# EAGLE design ArdUNO (EAGLE 7.3.0)
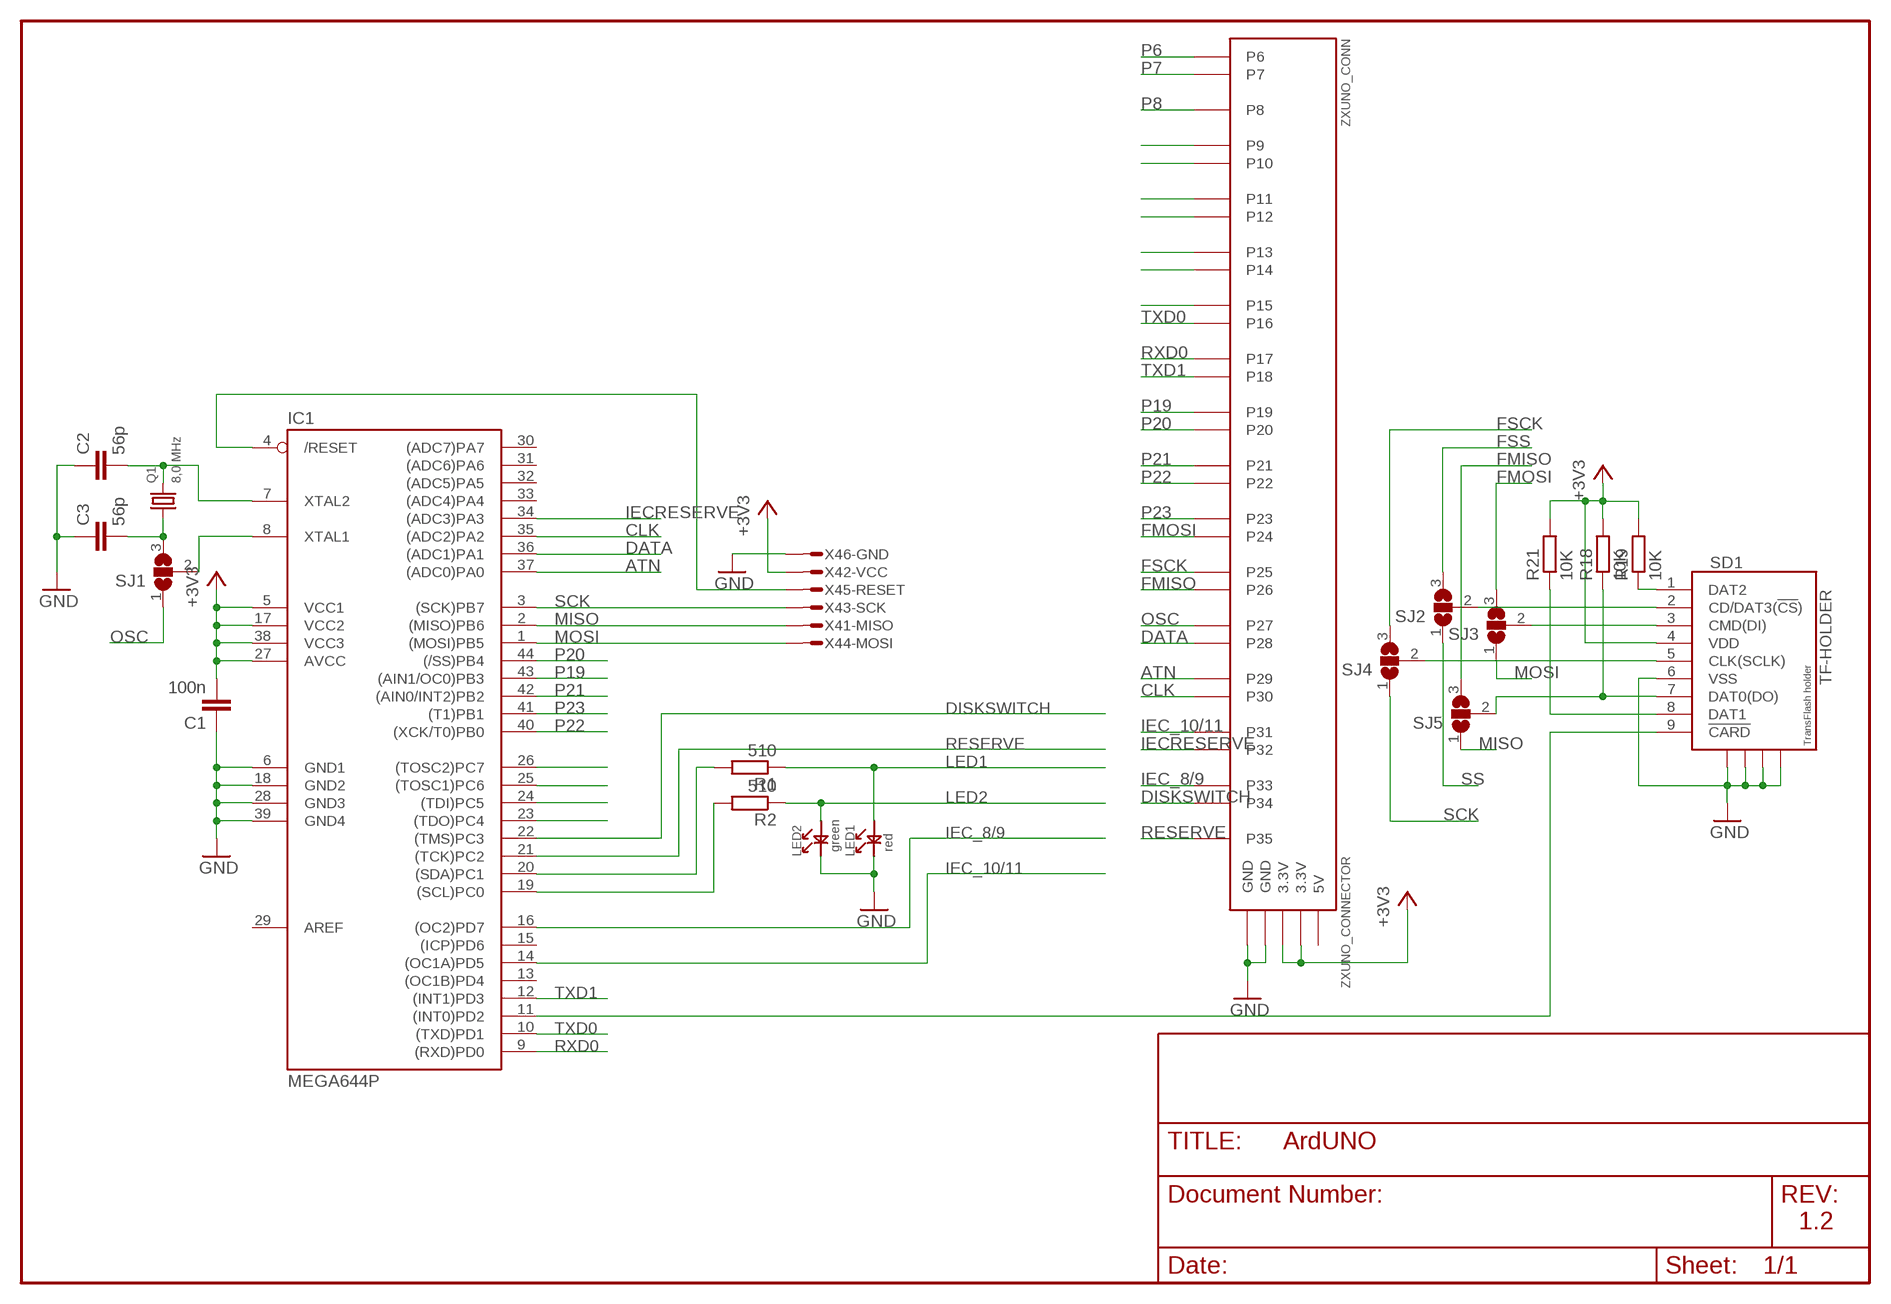
[diagram p0: schematic, sheet 1]

## Parts
C1  100n  C-EUC0805  [C0805]
C2  56p  C-EUC0805  [C0805]
C3  56p  C-EUC0805  [C0805]
IC1  MEGA644P  MEGA16/32TQFP  [TQFP44]
LED1  red  LED0805  [LED0805]
LED2  green  LED0805  [LED0805]
Q1  8,0 MHz  HC49  [HC49/S]
R1  510  R-EU_R0805  [R0805]
R2  510  R-EU_R0805  [R0805]
R18  10K  R-EU_R0805  [R0805]
R19  10K  R-EU_R0805  [R0805]
R21  10K  R-EU_R0805  [R0805]
SD1  TF-HOLDER  [TF-PULL]
SJ1  SJ2W  [SJ_2]
SJ2  SJ2W  [SJ_2]
SJ3  SJ2W  [SJ_2]
SJ4  SJ2W  [SJ_2]
SJ5  SJ2W  [SJ_2]
X4  AVR-ISP_1X6  [1X6_ISP]
ZXUNO_CONN  ZXUNO_CONNECTOR  [ZXUNO_CONNECTOR]

## Nets
+3V3 [power]: C1.2 IC1.5(VCC1) IC1.17(VCC2) IC1.27(AVCC) IC1.38(VCC3) R18.2 R19.2 R21.2 SD1.4(VDD) X4.2 ZXUNO_CONN.3.3V@1(3.3V) ZXUNO_CONN.3.3V@2(3.3V)
/RESET: IC1.4(/RESET) X4.5
ATN: IC1.37((ADC0)PA0) ZXUNO_CONN.P29
CD: IC1.11((INT0)PD2) SD1.9(!CARD)
CLK: IC1.35((ADC2)PA2) ZXUNO_CONN.P30
DATA: IC1.36((ADC1)PA1) ZXUNO_CONN.P28
DISKSWITCH: IC1.22((TMS)PC3) ZXUNO_CONN.P34
FMISO: SJ5.3 ZXUNO_CONN.P26
FMOSI: SJ3.3 ZXUNO_CONN.P24
FSCK: SJ4.3 ZXUNO_CONN.P25
FSS: SJ2.3
GND: C1.1 C2.1 C3.1 IC1.6(GND1) IC1.18(GND2) IC1.28(GND3) IC1.39(GND4) LED1.1 LED2.1 SD1.6(VSS) SD1.S1 SD1.S2 SD1.S3 SD1.S4 X4.6 ZXUNO_CONN.GND@1(GND) ZXUNO_CONN.GND@2(GND)
IEC_8/9: IC1.16((OC2)PD7) ZXUNO_CONN.P33
IEC_10/11: IC1.14((OC1A)PD5) ZXUNO_CONN.P31
IECRESERVE: IC1.34((ADC3)PA3) ZXUNO_CONN.P32
LED1: LED1.2 R1.1
LED2: LED2.2 R2.1
MISO: IC1.2((MISO)PB6) SJ5.1 X4.1
MOSI: IC1.1((MOSI)PB5) SJ3.1 X4.4
N$1: IC1.23((TDO)PC4)
N$2: R18.1 SD1.7(DAT0(DO)) SJ5.2
N$3: SD1.3(CMD(DI)) SJ3.2
N$4: C3.2 Q1.1 SJ1.3
N$5: C2.2 IC1.7(XTAL2) Q1.2
N$6: SD1.2(CD/DAT3(!CS!)) SJ2.2
N$7: IC1.24((TDI)PC5)
N$8: IC1.8(XTAL1) SJ1.2
N$9: R19.1 SD1.1(DAT2)
N$10: SD1.5(CLK(SCLK)) SJ4.2
N$11: IC1.25((TOSC1)PC6)
N$12: IC1.26((TOSC2)PC7)
N$13: R21.1 SD1.8(DAT1)
OSC: SJ1.1 ZXUNO_CONN.P27
P6: ZXUNO_CONN.P6
P7: ZXUNO_CONN.P7
P8: ZXUNO_CONN.P8
P9: ZXUNO_CONN.P9
P10: ZXUNO_CONN.P10
P11: ZXUNO_CONN.P11
P12: ZXUNO_CONN.P12
P13: ZXUNO_CONN.P13
P14: ZXUNO_CONN.P14
P15: ZXUNO_CONN.P15
P19: IC1.43((AIN1/OC0)PB3) ZXUNO_CONN.P19
P20: IC1.44((/SS)PB4) ZXUNO_CONN.P20
P21: IC1.42((AIN0/INT2)PB2) ZXUNO_CONN.P21
P22: IC1.40((XCK/T0)PB0) ZXUNO_CONN.P22
P23: IC1.41((T1)PB1) ZXUNO_CONN.P23
PC0: IC1.19((SCL)PC0) R2.2
PC1: IC1.20((SDA)PC1) R1.2
RESERVE: IC1.21((TCK)PC2) ZXUNO_CONN.P35
RXD0: IC1.9((RXD)PD0) ZXUNO_CONN.P17
SCK: IC1.3((SCK)PB7) SJ4.1 X4.3
SS: SJ2.1
TXD0: IC1.10((TXD)PD1) ZXUNO_CONN.P16
TXD1: IC1.12((INT1)PD3) ZXUNO_CONN.P18
Unconnected: IC1.13((OC1B)PD4) IC1.15((ICP)PD6) IC1.29(AREF) IC1.30((ADC7)PA7) IC1.31((ADC6)PA6) IC1.32((ADC5)PA5) IC1.33((ADC4)PA4)

## Notes on the sheet
- 1.2

## Power pins joined to a net without a drawn wire
5V: ZXUNO_CONN.5V

## Library data of the parts
C1-C3 = rcl:C-EU: CAPACITOR, European symbol
IC1 = 0_rr:MEGA16/32: MICROCONTROLLER 16 Kbytes FLASH, 512 bytes EEPROM 1 Kbytes SRAM dual UART hardware multiplier
LED1 LED2 = 0_rr:LED
Q1 = 0_rr:HC49
R1 R2 R18 R19 R21 = rcl:R-EU_: RESISTOR, European symbol
SD1 = sd-mmc:TF-HOLDER: TF / Micro SD socket is PUSH-PUSH type, the card can be pushed into and auto locked and pushed out by simply press the card. Surface Mounting type.
SJ1-SJ5 = jumper:SJ2W: SMD solder JUMPER
X4 = 0_rr:AVR-ISP: MicroMaTch 6 7-215464-6 / 0-215464-6 Drawing Number C-215464 DDEController.pdf
ZXUNO_CONN = zxuno:ZXUNO_CONNECTOR

## Net classes
0 default: width 0.178 mm, clearance 0.178 mm
1 power: width 0.305 mm, clearance 0.178 mm to class 0, clearance 0.229 mm

## Board
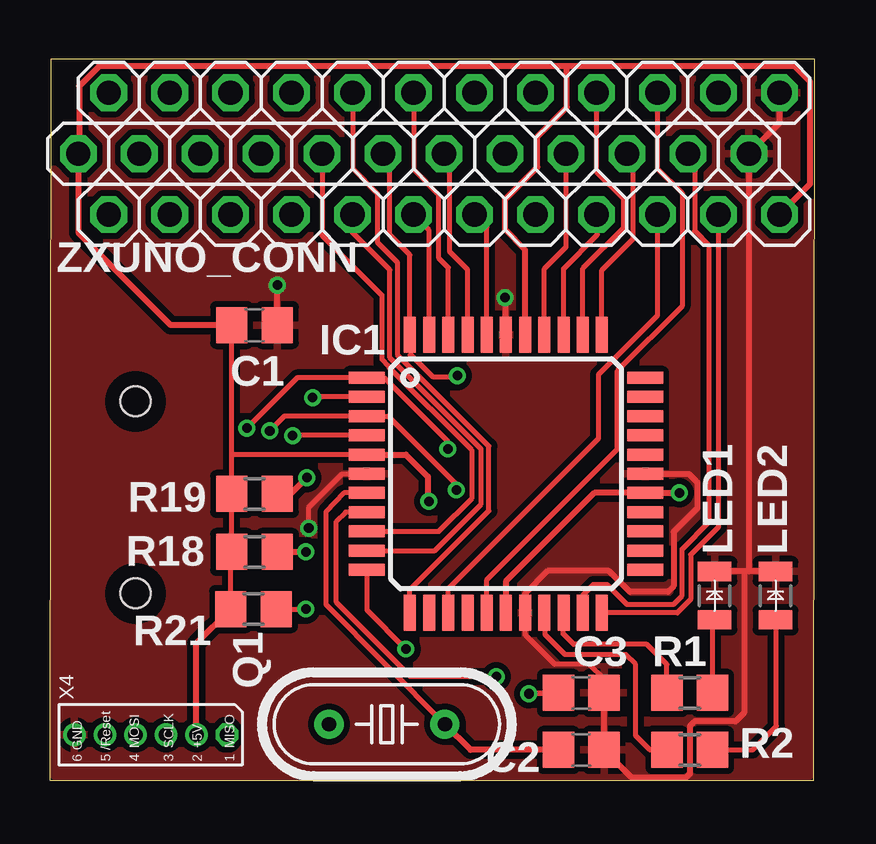
[diagram p1: board, top side]
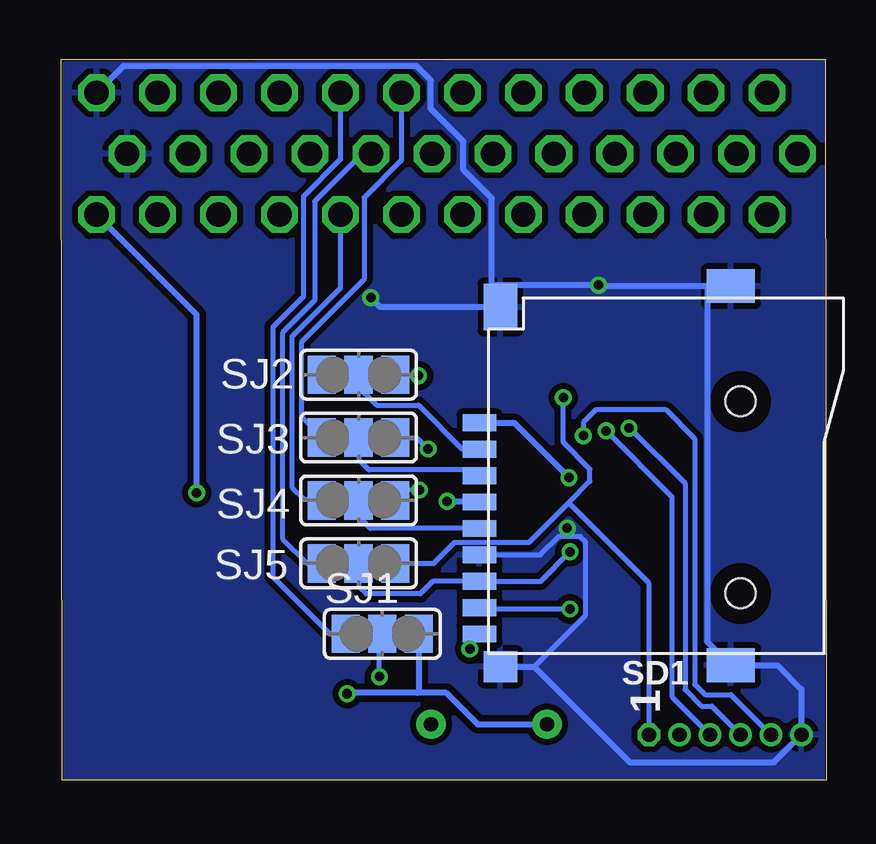
[diagram p2: board, bottom side, seen from below]

No outline drawn. Coordinates in mm, seen from the top.
Copper layers (1*16): Top 0.035mm / dielectric 1.5mm / Bottom 0.035mm
Design rules "default": minimum track width 8mil, minimum drill 12mil, track to track 8mil, track to pad 8mil, pad to pad 8mil, via to via 8mil, smd to smd 8mil, copper to edge 25mil, drill to drill 8mil, minimum pad ring 6mil, minimum via ring 6mil, stop-mask expansion 4mil, vias tented up to drill 12mil, thermal gap 10mil
Milling: 4 lines

### Footprints (pad centres in the part's own frame; a part is rotated, then mirrored left to right if it is on the bottom)
C0805 = smd 1.3 x 1.5: 1 -0.95,0; 2 0.95,0
TQFP44 = smd 1.5 x 0.5: 1 -5.8,4; 2 -5.8,3.2; 3 -5.8,2.4; 4 -5.8,1.6; 5 -5.8,0.8; 6 -5.8,0; 7 -5.8,-0.8; 8 -5.8,-1.6; 9 -5.8,-2.4; 10 -5.8,-3.2; 11 -5.8,-4; 23 5.8,-4; 24 5.8,-3.2; 25 5.8,-2.4; 26 5.8,-1.6; 27 5.8,-0.8; 28 5.8,0; 29 5.8,0.8; 30 5.8,1.6; 31 5.8,2.4; 32 5.8,3.2; 33 5.8,4 | smd 0.5 x 1.5: 12 -4,-5.8; 13 -3.2,-5.8; 14 -2.4,-5.8; 15 -1.6,-5.8; 16 -0.8,-5.8; 17 0,-5.8; 18 0.8,-5.8; 19 1.6,-5.8; 20 2.4,-5.8; 21 3.2,-5.8; 22 4,-5.8; 34 4,5.8; 35 3.2,5.8; 36 2.4,5.8; 37 1.6,5.8; 38 0.8,5.8; 39 0,5.8; 40 -0.8,5.8; 41 -1.6,5.8; 42 -2.4,5.8; 43 -3.2,5.8; 44 -4,5.8
LED0805 = smd 0.8 x 1.4: 1 -1.009,0; 2 1.009,0
HC49/S = drill 0.6 pad 1.219: 1 -2.413,0; 2 2.413,0
R0805 = smd 1.3 x 1.5: 1 -0.95,0; 2 0.95,0
TF-PULL = smd 0.7 x 1.4: 1 -2.2,-7.62; 2 -1.1,-7.62; 3 0,-7.62; 4 1.1,-7.62; 5 2.2,-7.62; 6 3.3,-7.62; 7 4.4,-7.62; 8 5.5,-7.62; 9 6.6,-7.62 | smd 1.4 x 2: S1 -7.9,2.85; S2 7.9,2.85 | smd 1.28 x 1.4: S3 7.96,-6.75 | smd 1.95 x 1.4: S4 -7.025,-6.75 | hole 1.25: -3.1,3.25; 4.9,3.25
SJ_2 = smd 1.168 x 1.6: 1 -1.524,0; 2 0,0; 3 1.524,0
1X6_ISP = drill 0.6 pad 0.94 octagon: 1 0,0 | drill 0.6 pad 0.94: 2 1.27,0; 3 2.54,0; 4 3.81,0; 5 5.08,0; 6 6.35,0
ZXUNO_CONNECTOR = drill 1.016 octagon: 3.3V@1 -13.97,0; 3.3V@2 15.24,-2.54; 5V -12.7,-2.54; GND@1 15.24,2.54; GND@2 13.97,0; NC@1 12.7,2.54; P6 -12.7,2.54; P7 -10.16,-2.54; P8 -11.43,0; P9 -10.16,2.54; P10 -7.62,-2.54; P11 -8.89,0; P12 -7.62,2.54; P13 -5.08,-2.54; P14 -6.35,0; P15 -5.08,2.54; P16 -2.54,-2.54; P17 -3.81,0; P18 -2.54,2.54; P19 0,-2.54; P20 -1.27,0; P21 0,2.54; P22 2.54,-2.54; P23 1.27,0; P24 2.54,2.54; P25 5.08,-2.54; P26 3.81,0; P27 5.08,2.54; P28 7.62,-2.54; P29 6.35,0; P30 7.62,2.54; P31 10.16,-2.54; P32 8.89,0; P33 10.16,2.54; P34 12.7,-2.54; P35 11.43,0

### Placement (x,y rotation side)
C1  8.52,18.97 180 top
C2  22.13,1.27 180 top
C3  22.13,3.65 180 top
IC1  19,12.78 0 top
LED1  27.69,7.7 270 top
LED2  30.23,7.7 270 top
Q1  14.04,2.34 0 top
R1  26.66,3.65 180 top
R2  26.66,1.27 180 top
R18  8.52,9.52 180 top
R19  8.52,11.94 180 top
R21  8.48,7.14 180 top
SD1  6.81,12.7 270 bottom
SJ1  18.48,6.11 0 bottom
SJ2  19.47,16.9 180 bottom
SJ3  19.47,14.28 180 bottom
SJ4  19.47,11.66 180 bottom
SJ5  19.47,9.05 180 bottom
X4  7.37,1.9 180 top
ZXUNO_CONN  15.15,26.11 0 top

### Tracks (layer width: path | path; a pad name or v marks a point on that pad's centre or on a via)
+3V3  (via drill 0.4)
  Top 0.203: R21.2 7.53,10.24 R18.2 R19.2 7.57,13.53 | 7.57,13.53 C1.2 | IC1.5 7.62,13.58 7.57,13.53
  Top 0.254: C1.2 5.03,18.97 1.18,22.82 ZXUNO_CONN.3.3V@1 1.22,26.15 1.22,28.93 2.05,29.76 21.54,29.76 | IC1.17 19,8.29 22.68,11.98 IC1.27 v26.21,11.98 v26.22,11.98 | IC1.17 | IC1.5 14.82,13.58 15.74,12.66 15.74,11.66 v15.78,11.62 | IC1.38 19.8,22.1 18.96,22.94 18.96,24.21 20.31,25.55 20.31,26.82 21.54,28.06 21.54,29.76 | ZXUNO_CONN.3.3V@2 31.66,24.84 31.66,29.13 31.02,29.76 21.54,29.76 | X4.2 6.1,5.71 R21.2
  Bottom 0.254: v15.78,11.62 14.46,11.62 SD1.4 | v26.22,11.98 26.22,19.4 ZXUNO_CONN.3.3V@2
/RESET  (via drill 0.4)
  Top 0.203: IC1.4 10.12,14.38 v10.11,14.36
  Bottom 0.203: X4.5 3.96,3.57 5.03,3.57 5.46,4 5.46,14.24 6.65,15.44 9.59,15.44 10.11,14.92 v10.11,14.36
ATN
  Top 0.203: ZXUNO_CONN.P29 21.5,22.22 20.6,21.32 IC1.37
CD  (via drill 0.4)
  Top 0.203: IC1.11 13.2,7.11 v14.83,5.47
  Bottom 0.203: v14.83,5.47 14.83,5.7 SD1.9
CLK
  Top 0.203: IC1.35 22.2,21.33 23.88,23.02 23.88,24.25 22.77,25.36 ZXUNO_CONN.P30
DATA
  Top 0.203: IC1.36 21.4,21.33 22.81,22.74 22.81,23.53 ZXUNO_CONN.P28
DISKSWITCH
  Top 0.203: ZXUNO_CONN.P34 27.85,10.55 26.7,9.4 26.7,7.54 26.14,6.98 IC1.22
FMISO
  Bottom 0.203: ZXUNO_CONN.P26 19.31,26.11 21.3,24.13 21.3,20 22.65,18.65 22.65,10.08 21.62,9.04 SJ5.3
FMOSI
  Bottom 0.203: ZXUNO_CONN.P24 17.69,25.83 19.23,24.29 19.23,20.87 21.85,18.25 21.85,15.14 SJ3.3
FSCK
  Bottom 0.203: ZXUNO_CONN.P25 20.23,20.52 22.25,18.49 22.25,12.22 21.73,11.7 21.04,11.7 SJ4.3
GND  (via drill 0.4)
  Top 0.203: C3.1 23.08,4.21 22.45,4.84 21.02,4.84 19.79,6.07 IC1.18 | v10.78,10.51 10.78,11.39 12.17,12.78 IC1.6 | IC1.6
  Top 0.254: C3.1 C2.1 24.23,0.12 26.5,0.12 26.66,0.27 26.66,2.26 26.86,2.46 28.56,2.46 28.92,2.81 28.92,8.66 28.88,8.7 | IC1.18 | IC1.18 | LED2.1 29.12,8.7 | 29.12,8.7 28.88,8.7 | 28.88,8.7 LED1.1 | ZXUNO_CONN.GND@1 30.39,27.38 ZXUNO_CONN.GND@2 29.12,8.7 | IC1.28 26.62,12.78 26.97,12.42 26.97,11.35 25.98,10.36 25.98,8.09 25.74,7.86 24.16,7.86 23.28,8.73 20.74,8.73 19.79,7.78 19.8,7.77 IC1.18 | C1.1 v9.47,20.63 | 19.04,20.12 v18.96,20.12 19,20.08 IC1.39
  Bottom 0.203: SD1.6 11.9,9.4 11.14,10.16 10.82,10.16 | 12.15,4.74 10.03,6.86 10.03,9.96 10.23,10.16 10.82,10.16 | v10.78,10.51 10.78,10.2 10.82,10.16
  Bottom 0.254: SD1.S3 12.15,4.74 8.16,0.75 2.17,0.75 X4.6 1.02,3.81 2.01,4.8 SD1.S2 4.95,5.78 4.95,20.6 | SD1.S1 4.95,20.6 | 4.95,20.6 9.43,20.6 v9.47,20.63 13.76,20.63 13.92,20.48 | v18.96,20.12 18.56,19.72 SD1.S4 13.92,19.72 | 13.92,19.72 | 13.92,19.72 13.92,20.48 | 13.92,20.48 13.92,24.25 15.11,25.44 15.11,26.63 16.46,27.98 16.46,29.17 17.05,29.76 29.28,29.76 ZXUNO_CONN.GND@1
  pour Top (isolate 0.254): 0.15,0.19 0.19,29.88 31.66,29.84 31.66,0.2
  pour Bottom (isolate 0.254): 0.15,0.16 0.15,29.92 31.7,29.84 31.66,0.16
IEC_8/9
  Top 0.203: IC1.16 18.2,8.36 23.64,13.81 23.64,17.06 26.34,19.76 26.34,24.48 25.31,25.52 ZXUNO_CONN.P33
IEC_10/11
  Top 0.203: ZXUNO_CONN.P31 25.31,19.36 22.85,16.9 22.85,14.24 16.6,7.99 IC1.14
IECRESERVE
  Top 0.203: IC1.34 23,21.26 24.27,22.54 24.27,25.91 24.08,26.11 ZXUNO_CONN.P32
LED1
  Top 0.203: R1.1 27.61,6.61 LED1.2
LED2
  Top 0.203: R2.1 29.28,1.27 30.27,2.26 30.27,6.61 LED2.2
MISO  (via drill 0.4)
  Top 0.203: IC1.2 10.96,15.98 v10.94,15.95
  Bottom 0.203: X4.1 7.37,8.21 10.72,11.56 | v10.94,15.95 10.94,14.09 9.83,12.97 9.83,12.46 10.72,11.56 | SJ5.1 16.34,9.04 15.46,9.92 12.37,9.92 10.72,11.56
MOSI  (via drill 0.4)
  Top 0.203: 8.16,14.72 v8.2,14.68 10.3,16.78 IC1.1 13.93,16.78 16.58,14.12 v16.58,13.81
  Bottom 0.203: v8.2,14.68 8.16,14.68 5.86,12.38 5.86,3.77 5.19,3.09 4.75,3.09 X4.4 | SJ3.1 17.05,14.28 v16.58,13.81
N$2  (via drill 0.4)
  Top 0.254: R18.1 v10.66,9.52
  Bottom 0.203: SJ5.2 19.43,9.01 19.43,8.05 19.16,7.78 16.89,7.78 16.37,8.3 SD1.7 11.89,8.3 v10.66,9.52
N$3
  Bottom 0.203: SD1.3 14.83,12.7 15.07,12.94 19.04,12.94 19.43,13.33 19.43,14.24 SJ3.2
N$4  (via drill 0.4)
  Top 0.254: C3.2 v19.95,3.61
  Bottom 0.254: SJ1.3 16.96,3.7 17.01,3.65 | Q1.1 14.51,2.34 15.82,3.65 17.01,3.65 | Q1.1 | 17.01,3.65 19.91,3.65 v19.95,3.61
N$5
  Top 0.203: IC1.7 12.24,11.98 11.5,11.19 11.5,7.33 Q1.2
  Top 0.254: C2.2 17.52,1.27 Q1.2
N$6
  Bottom 0.203: 14.44,13.81 15.15,13.81 16.97,15.63 18.72,15.63 19.47,16.39
  Bottom 0.254: SJ2.2 19.47,16.39 | 14.44,13.81 SD1.2
N$8  (via drill 0.4)
  Top 0.203: IC1.8 12.32,11.18 11.93,10.79 11.93,7.42 15.03,4.32 v18.6,4.32
  Bottom 0.203: v18.6,4.32 18.6,5.99 SJ1.2
N$9  (via drill 0.4)
  Top 0.254: R19.1 10.03,11.94 v10.7,12.62
  Bottom 0.254: SD1.1 12.98,14.9 v10.7,12.62
N$10
  Bottom 0.203: SD1.5 18.98,10.5 19.47,10.99 SJ4.2
N$13  (via drill 0.4)
  Top 0.203: R21.1 v10.66,7.14
  Bottom 0.203: v10.66,7.14 14.38,7.14 SD1.8
OSC
  Bottom 0.203: ZXUNO_CONN.P27 20.23,25.87 21.77,24.32 21.77,20.16 23.05,18.89 23.05,8.49 20.66,6.11 SJ1.1
P19
  Top 0.203: IC1.43 15.8,22.92 ZXUNO_CONN.P19
P20
  Top 0.203: IC1.44 15,21.9 14.15,22.74 14.15,25.83 ZXUNO_CONN.P20
P21
  Top 0.203: ZXUNO_CONN.P21 15.15,25.44 16.18,24.4 16.18,21.79 16.6,21.37 IC1.42
P22
  Top 0.203: IC1.40 18.2,23.06 ZXUNO_CONN.P22
P23
  Top 0.203: IC1.41 17.4,21.28 16.66,22.02 16.66,25.87 ZXUNO_CONN.P23
PC0
  Top 0.203: R2.2 24.99,1.27 24.39,1.86 24.39,4.84 24,5.24 21.46,5.24 20.62,6.07 20.62,6.95 IC1.19
PC1
  Top 0.203: 21.38,6.96 21.38,6.11 21.82,5.67 24.87,5.67 25.71,4.84 R1.2
  Top 0.254: 21.38,6.96 IC1.20
RESERVE
  Top 0.203: ZXUNO_CONN.P35 26.86,25.83 26.86,22.9 27.45,22.3 27.45,10.75 26.34,9.64 26.34,7.7 25.98,7.34 24.04,7.34 23.2,8.17 22.65,8.17 22.2,7.72 IC1.21
RXD0
  Top 0.203: IC1.9 16.2,10.38 17.57,11.74 17.57,13.77 14.12,17.22 14.12,17.26 13.84,17.54 13.84,20.2 11.34,22.7 ZXUNO_CONN.P17
SCK  (via drill 0.4)
  Top 0.203: v9.15,14.56 9.77,15.18 IC1.3 14.1,15.18 16.93,12.34 v16.93,12.1
  Bottom 0.203: v16.93,12.1 17.53,12.09 SJ4.1 | v9.15,14.56 6.42,11.82 6.42,3.49 X4.3
SS  (via drill 0.4)
  Top 0.203: 15,17.73 15.04,17.73 15.94,16.82 16.93,16.82 v16.97,16.86
  Bottom 0.203: v16.97,16.86 17.91,16.86 SJ2.1
TXD0
  Top 0.203: IC1.10 16.04,9.58 17.96,11.51 17.96,13.81 14.15,17.62 14.15,21.27 12.61,22.82 ZXUNO_CONN.P16
TXD1
  Top 0.203: IC1.12 15,7.94 18.28,11.23 18.28,13.93 14.47,17.74 14.47,21.59 13.64,22.42 13.64,24.44 12.61,25.48 ZXUNO_CONN.P18

### Text on the board
tPlace: 6 | GND | /Reset | 5 | 4 | MOSI | 3 | SCLK | +5V | 2 | 1 | MISO
bNames: 1